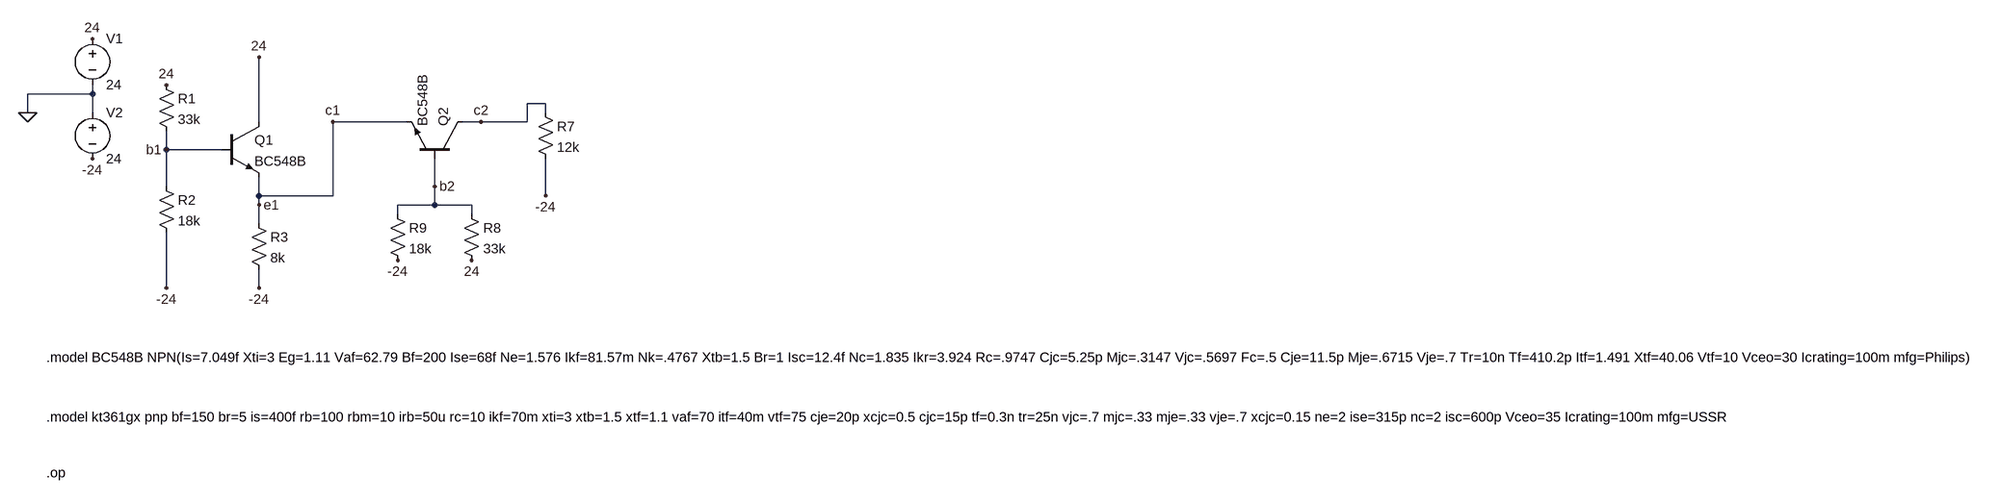
[diagram p0: schematic 211016polarizacion.asc]
211016polarizacion.asc, the LTspice schematic file:
Version 4
SHEET 1 3576 680
WIRE -64 -16 -64 -32
WIRE -64 -16 -176 -16
WIRE 720 0 688 0
WIRE -176 16 -176 -16
WIRE -64 16 -64 -16
WIRE 720 16 720 0
WIRE 224 32 224 -80
WIRE 480 32 352 32
WIRE 608 32 576 32
WIRE 688 32 688 0
WIRE 688 32 608 32
WIRE 64 80 64 48
WIRE 160 80 64 80
WIRE 64 144 64 80
WIRE 528 144 528 96
WIRE 224 160 224 128
WIRE 352 160 352 32
WIRE 352 160 224 160
WIRE 720 160 720 96
WIRE 224 176 224 160
WIRE 528 176 528 144
WIRE 528 176 464 176
WIRE 592 176 528 176
WIRE 464 192 464 176
WIRE 592 192 592 176
WIRE 224 208 224 176
WIRE 64 320 64 224
WIRE 224 320 224 288
FLAG 608 32 c2
FLAG -64 -112 24
FLAG 64 -32 24
FLAG 592 272 24
FLAG 352 32 c1
FLAG 64 80 b1
FLAG 224 176 e1
FLAG 528 144 b2
FLAG -176 16 0
FLAG -64 96 -24
FLAG 720 160 -24
FLAG 64 320 -24
FLAG 224 320 -24
FLAG 464 272 -24
FLAG 224 -80 24
SYMBOL res 48 -48 R0
SYMATTR InstName R1
SYMATTR Value 33k
SYMBOL res 48 128 R0
SYMATTR InstName R2
SYMATTR Value 18k
SYMBOL res 704 0 R0
SYMATTR InstName R7
SYMATTR Value 12k
SYMBOL voltage -64 -128 R0
SYMATTR InstName V1
SYMATTR Value 24
SYMBOL res 576 176 R0
SYMATTR InstName R8
SYMATTR Value 33k
SYMBOL res 448 176 R0
SYMATTR InstName R9
SYMATTR Value 18k
SYMBOL npn 160 32 R0
SYMATTR InstName Q1
SYMATTR Value BC548B
SYMBOL res 208 192 R0
SYMATTR InstName R3
SYMATTR Value 8k
SYMBOL voltage -64 0 R0
SYMATTR InstName V2
SYMATTR Value 24
SYMBOL npn 576 96 M270
SYMATTR InstName Q2
SYMATTR Value BC548B
TEXT -144 440 Left 2 !.model BC548B NPN(Is=7.049f Xti=3 Eg=1.11 Vaf=62.79 Bf=200 Ise=68f Ne=1.576 Ikf=81.57m Nk=.4767 Xtb=1.5 Br=1 Isc=12.4f Nc=1.835 Ikr=3.924 Rc=.9747 Cjc=5.25p Mjc=.3147 Vjc=.5697 Fc=.5 Cje=11.5p Mje=.6715 Vje=.7 Tr=10n Tf=410.2p Itf=1.491 Xtf=40.06 Vtf=10 Vceo=30 Icrating=100m mfg=Philips)
TEXT -144 544 Left 2 !.model kt361gx pnp bf=150 br=5 is=400f rb=100 rbm=10 irb=50u rc=10 ikf=70m xti=3 xtb=1.5 xtf=1.1 vaf=70 itf=40m vtf=75 cje=20p xcjc=0.5 cjc=15p tf=0.3n tr=25n vjc=.7 mjc=.33 mje=.33 vje=.7 xcjc=0.15 ne=2 ise=315p nc=2 isc=600p Vceo=35 Icrating=100m mfg=USSR
TEXT -144 640 Left 2 !.op

The netlist it stands for:
* 211016polarizacion.asc
R1 24 b1 33k
R2 b1 -24 18k
R7 c2 -24 12k
V1 24 0 24
R8 b2 24 33k
R9 b2 -24 18k
Q1 24 b1 e1 0 BC548B
R3 e1 -24 8k
V2 0 -24 24
Q2 c2 b2 e1 0 BC548B
.model NPN NPN
.model PNP PNP
.lib standard.bjt
.model BC548B NPN(Is=7.049f Xti=3 Eg=1.11 Vaf=62.79 Bf=200 Ise=68f Ne=1.576 Ikf=81.57m Nk=.4767 Xtb=1.5 Br=1 Isc=12.4f Nc=1.835 Ikr=3.924 Rc=.9747 Cjc=5.25p Mjc=.3147 Vjc=.5697 Fc=.5 Cje=11.5p Mje=.6715 Vje=.7 Tr=10n Tf=410.2p Itf=1.491 Xtf=40.06 Vtf=10 Vceo=30 Icrating=100m mfg=Philips)
.model kt361gx pnp bf=150 br=5 is=400f rb=100 rbm=10 irb=50u rc=10 ikf=70m xti=3 xtb=1.5 xtf=1.1 vaf=70 itf=40m vtf=75 cje=20p xcjc=0.5 cjc=15p tf=0.3n tr=25n vjc=.7 mjc=.33 mje=.33 vje=.7 xcjc=0.15 ne=2 ise=315p nc=2 isc=600p Vceo=35 Icrating=100m mfg=USSR
.op
.backanno
.end